# EAGLE board SparkFun_IoT_RedBoard-ESP32_v01 (EAGLE 9.6.2)
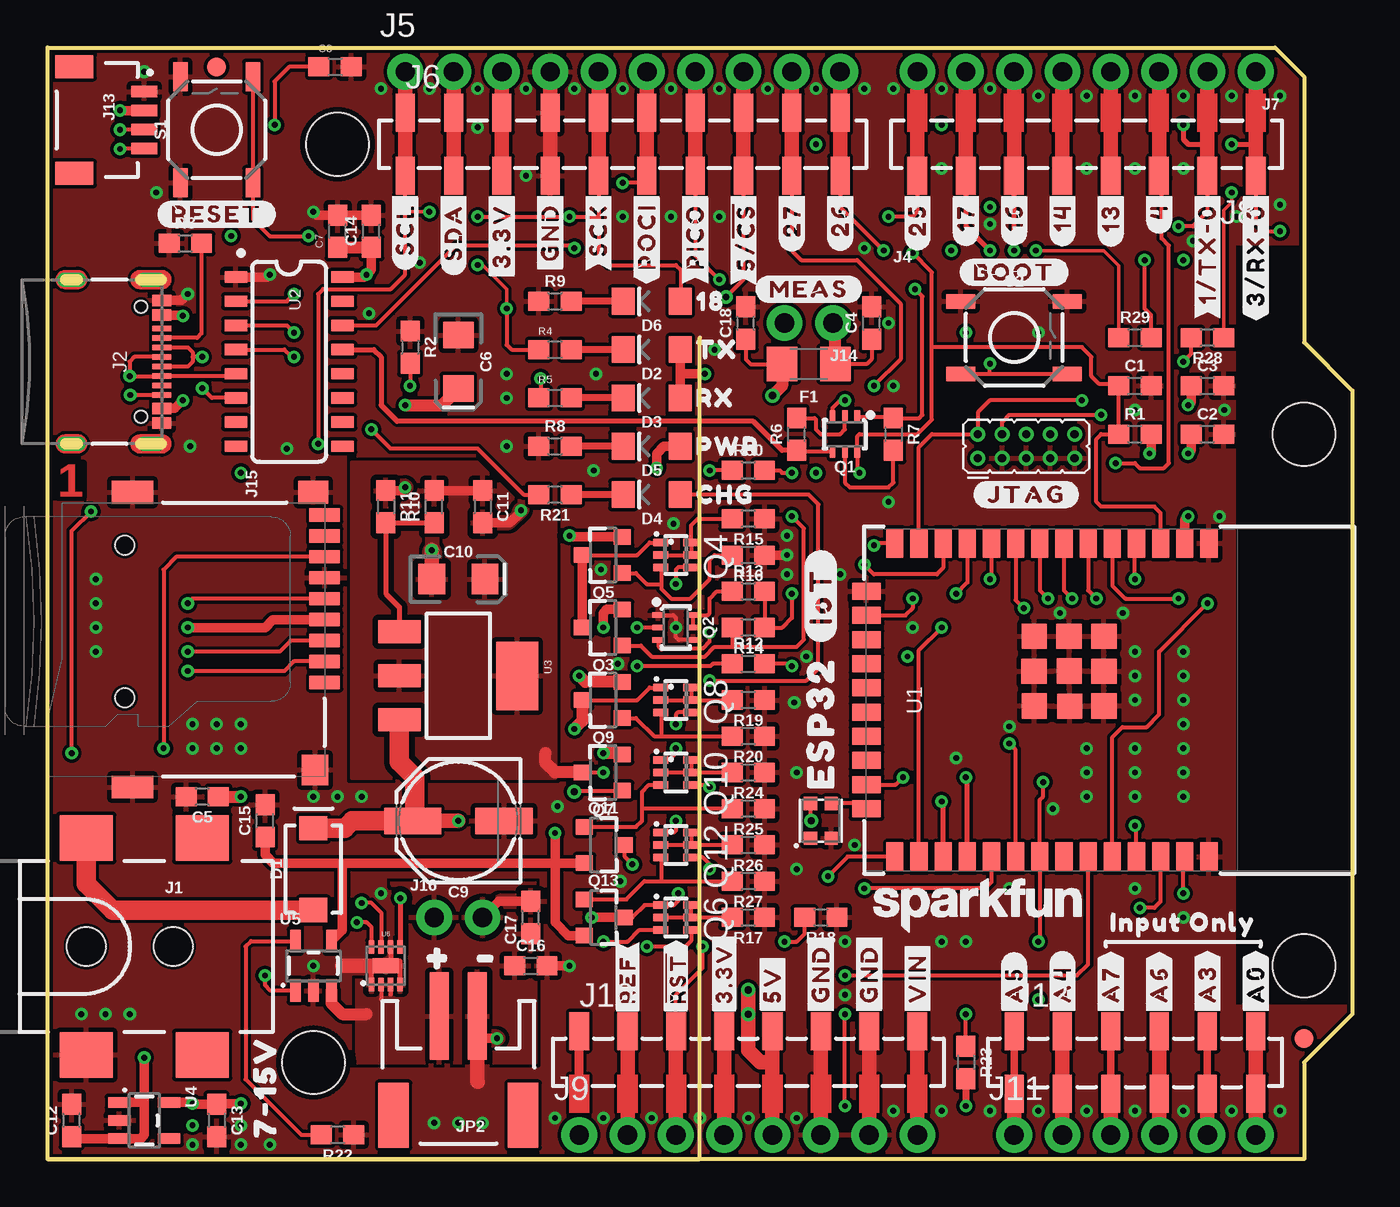
[diagram p1: board, top side]
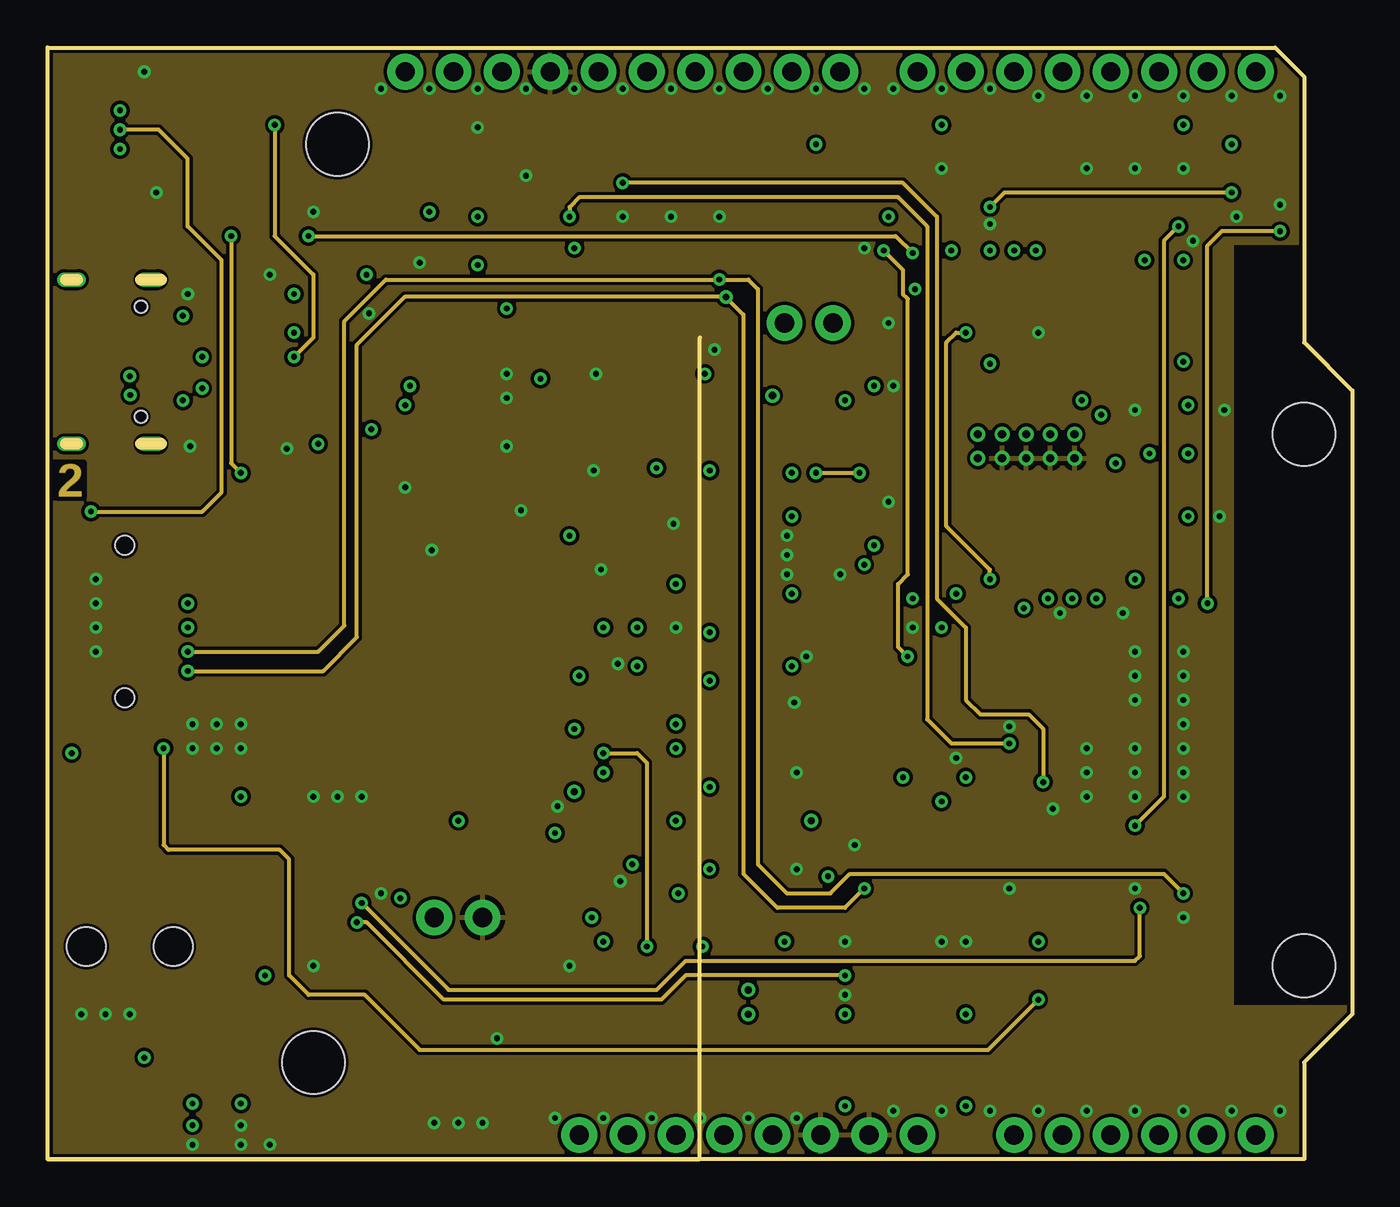
[diagram p2: board, inner layer Route2]
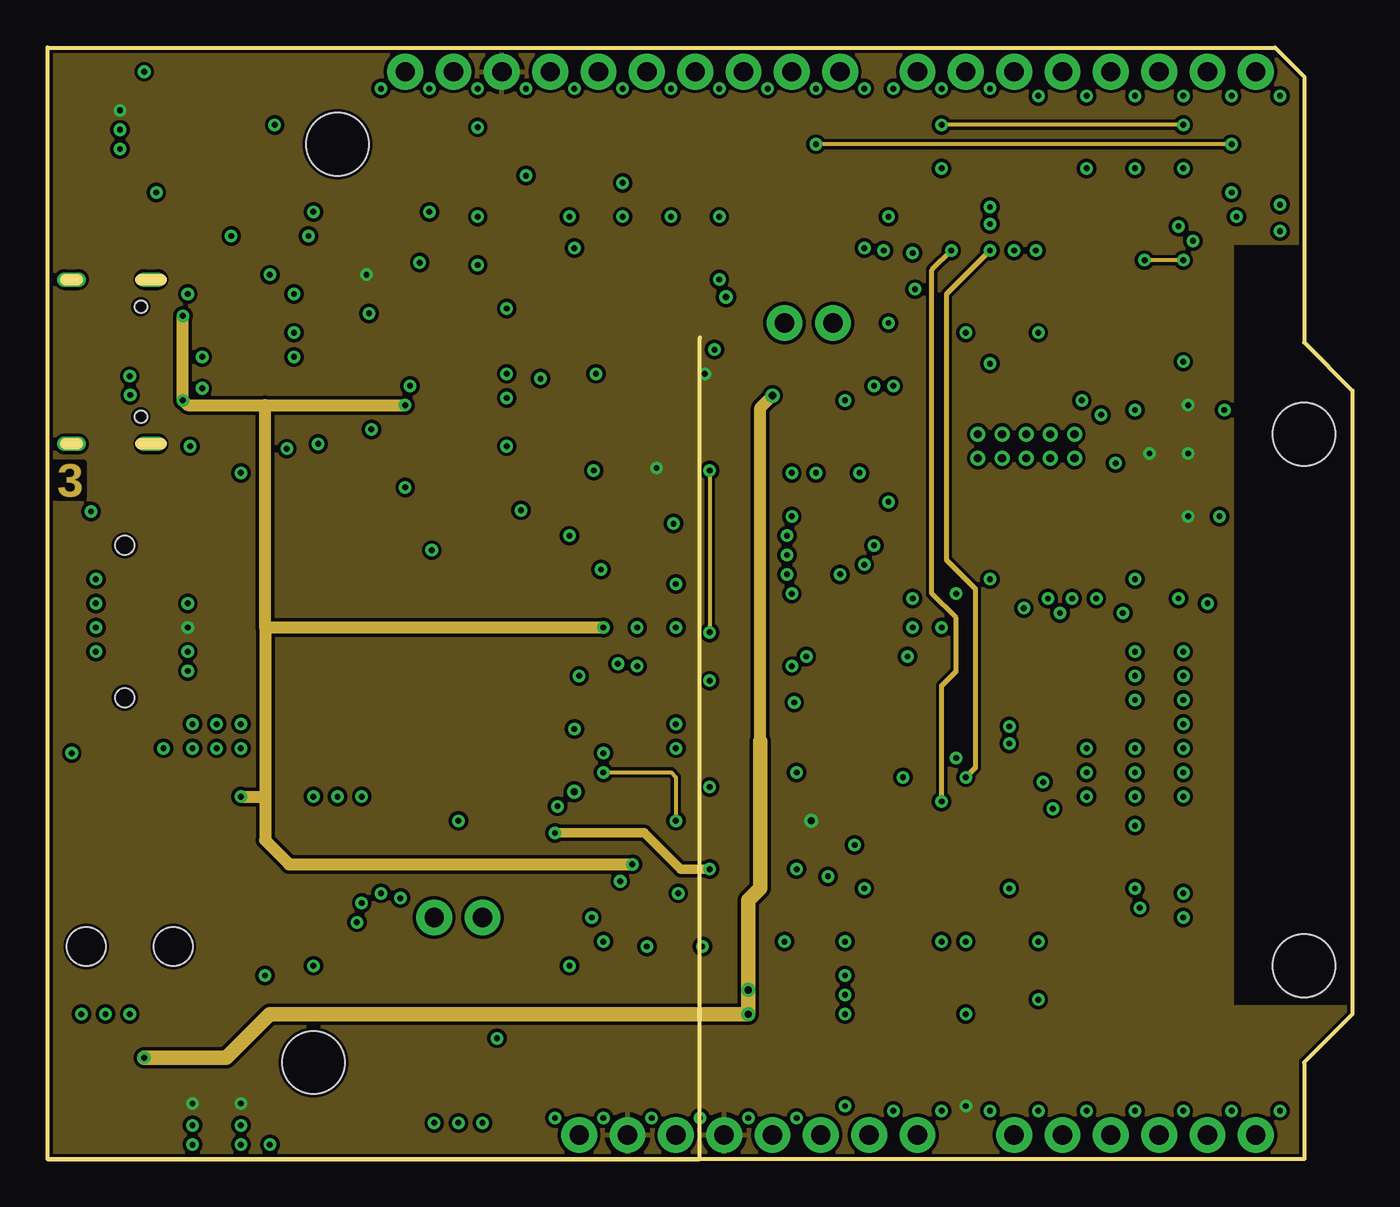
[diagram p3: board, inner layer Route15]
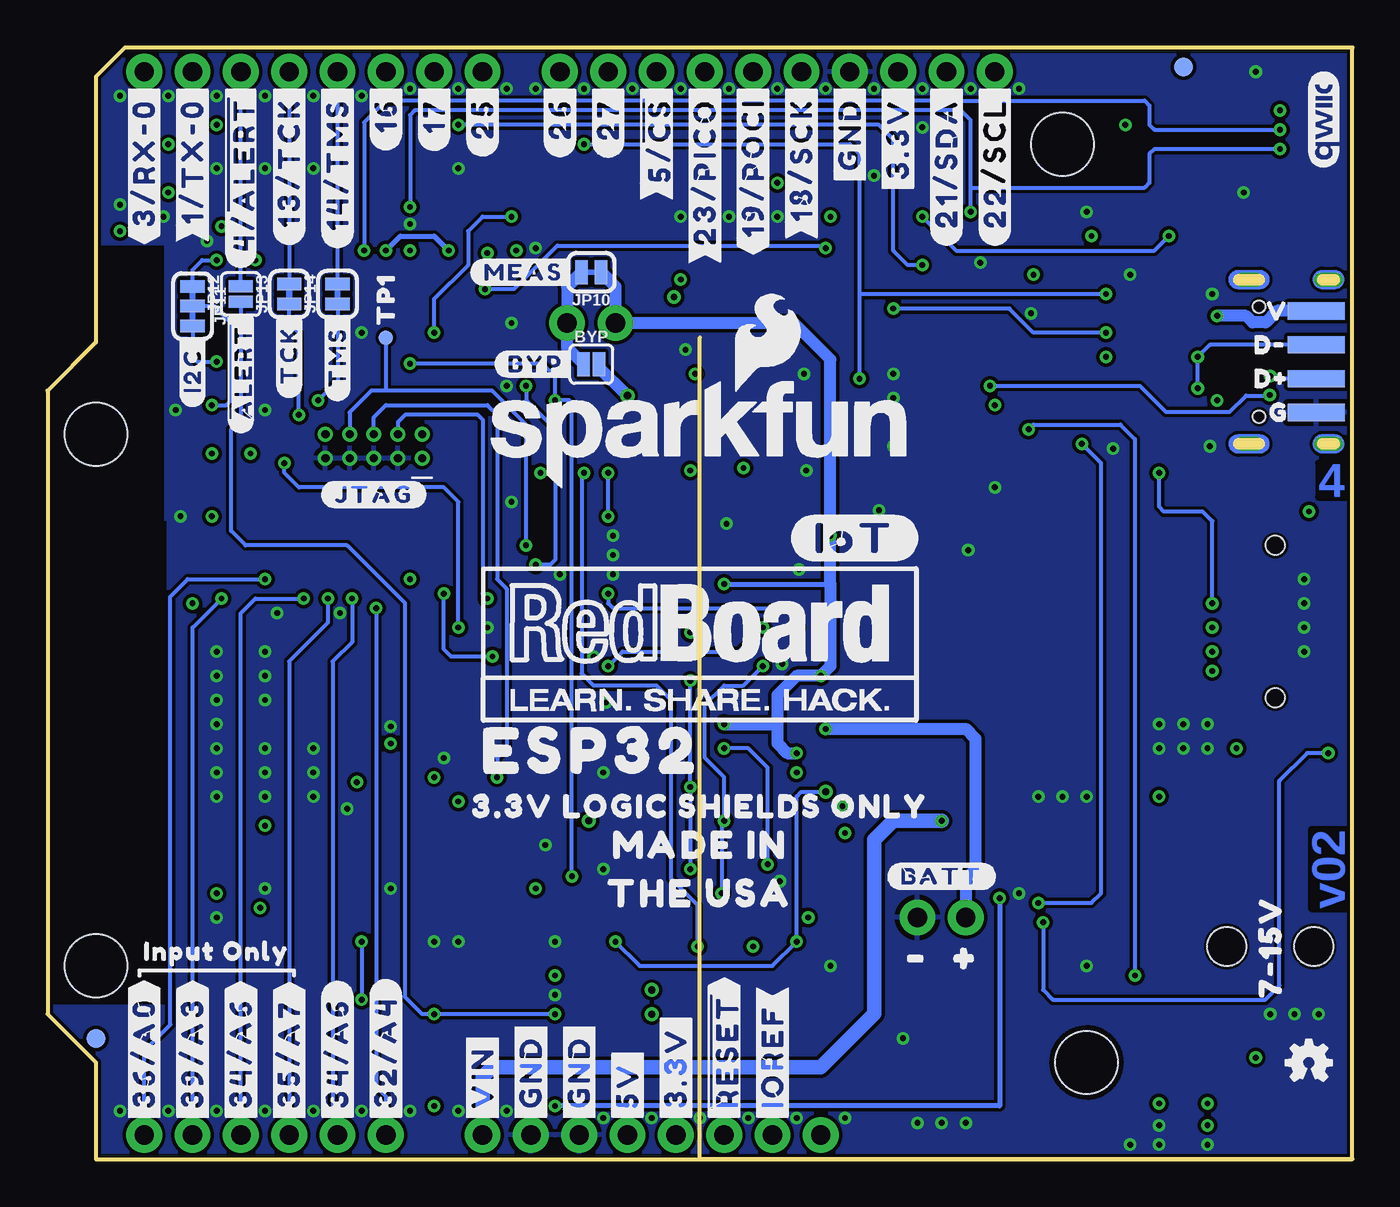
[diagram p4: board, bottom side, seen from below]

Size 68.58 x 58.42 mm. Coordinates in mm from the lower left corner, seen from the top.
Outline: 0,58.42 64.52,58.42 66.04,56.9 66.04,42.93 68.58,40.39 68.58,7.62 66.04,5.08 66.04,0 0,0 0,58.42
Copper layers (1+2*15+16): Top 0.035559375mm / dielectric 0.47751875mm / Route2 0.035559375mm / dielectric 0.47751875mm / Route15 0.035559375mm / dielectric 0.47751875mm / Bottom 0.035559375mm
Design rules "SparkFun-4-Layer-General-JLCPCB": minimum track width 7mil, minimum drill 12mil, track to track 7mil, track to pad 7mil, pad to pad 7mil, via to via 7mil, smd to smd 7mil, copper to edge 7mil, drill to drill 7mil, minimum pad ring 7mil, minimum via ring 7mil, stop-mask expansion 3mil, vias tented up to drill 25mil, thermal gap 10mil
tRestrict: area 62.5,8.1 to 68.6,48
bRestrict: area 62.5,15 to 68.6,33.3; area 62.5,8.1 to 68.6,48
vRestrict: area 0.6,22.4 to 2,30.6; area 5.7,23.1 to 7.4,30.6; area 47.9,10.8 to 48.5,11.3; area 50.4,10.7 to 50.9,11.6; area 11.3,29.3 to 12.7,31.6; area 0.3,13 to 9.4,25
Milling: 2 lines

## Footprints (pad centres in the part's own frame; a part is rotated, then mirrored left to right if it is on the bottom)
SMT-JUMPER_2_NO_SILK = smd 0.635 x 1.27: 1 -0.406,0; 2 0.406,0
0603 = smd 1.1 x 1: 1 -0.85,0; 2 0.85,0
EIA3216 = smd 1.4 x 1.6: + 1.4,0; - -1.4,0
PANASONIC_D = smd 3 x 1.4: + 2.4,0; - -2.4,0
SMA-DIODE = smd 1.27 x 1.47: A -2.15,0; C 2.15,0
LED-1206-HIDDENSILK = smd 1.2 x 1.4: A -1.5,0; C 1.5,0
WS2812-2020 = smd 0.7 x 0.7: DI -0.915,0.55; DO 0.915,-0.55; GND 0.915,0.55; VCC -0.915,-0.55
1206 = smd 1.6 x 1.8: 1 -1.4,0; 2 1.4,0
POWER_JACK_SMD = smd 2.8 x 2.4: GND 0,-5.7; P$4 6.1,-5.7; VIN0 0,5.7; VIN1 6.1,5.7 | hole 2.032: 0,0; 4.572,0
USB-C-16P-2LAYER-PADS = smd 0.3 x 1: A5 -1.25,-0.34; A6 -0.25,-0.34; A7 0.25,-0.34; A8 1.25,-0.34; B5 1.75,-0.34; B6 0.75,-0.34; B7 -0.75,-0.34; B8 -1.75,-0.34 | smd 0.6 x 1: GND -3.225,-0.34; GND2 3.225,-0.34; VBUS1 -2.45,-0.34; VBUS2 2.45,-0.34 | drill 0.4 pad 0.6 long: SHLD1 -4.318,-0.915; SHLD2 4.318,-0.915; SHLD3 -4.318,-5.095; SHLD4 4.318,-5.095 | hole 0.65: -2.89,-1.445; 2.89,-1.445
USB-SOLDER-PADS = smd 3 x 0.9: D+ 0,-0.889; D- 0,0.889; GND 0,-2.667; VBUS 0,2.667
2X5_PTH_SILK_.05 = drill 0.432: 1 0,0; 2 0,1.27; 3 1.27,0; 4 1.27,1.27; 5 2.54,0; 6 2.54,1.27; 7 3.81,0; 8 3.81,1.27; 9 5.08,0; 10 5.08,1.27
1X10_NO_SILK = drill 1.016 pad 1.88: 1 0,0; 2 2.54,0; 3 5.08,0; 4 7.62,0; 5 10.16,0; 6 12.7,0; 7 15.24,0; 8 17.78,0; 9 20.32,0; 10 22.86,0
1X10_SMD_COMBINED = smd 1 x 2: 1A 0,1.65; 1B 0,-1.65; 2A 2.54,1.65; 2B 2.54,-1.65; 3A 5.08,1.65; 3B 5.08,-1.65; 4A 7.62,1.65; 4B 7.62,-1.65; 5A 10.16,1.65; 5B 10.16,-1.65; 6A 12.7,1.65; 6B 12.7,-1.65; 7A 15.24,1.65; 7B 15.24,-1.65; 8A 17.78,1.65; 8B 17.78,-1.65; 9A 20.32,1.65; 9B 20.32,-1.65; 10A 22.86,1.65; 10B 22.86,-1.65
1X08_NO_SILK = drill 1.016 pad 1.88: 1 0,0; 2 2.54,0; 3 5.08,0; 4 7.62,0; 5 10.16,0; 6 12.7,0; 7 15.24,0; 8 17.78,0
1X08_SMD_COMBINED = smd 1 x 2: 1 0,1.65; 2 2.54,1.65; 3 5.08,1.65; 4 7.62,1.652; 5 10.16,1.65; 6 12.7,1.652; 7 15.24,1.65; 8 17.78,1.652
1X06_NO_SILK = drill 1.016 pad 1.88: 1 0,0; 2 2.54,0; 3 5.08,0; 4 7.62,0; 5 10.16,0; 6 12.7,0
1X06_SMD_STRAIGHT_COMBO = smd 1 x 2: 1 0,-1.65; 1-2 0,1.65; 2 2.54,1.65; 2-2 2.54,-1.65; 3 5.08,-1.65; 3-2 5.08,1.65; 4 7.62,1.65; 4-2 7.62,-1.65; 5 10.16,-1.65; 5-2 10.16,1.65; 6 12.7,1.65; 6-2 12.7,-1.65
JST04_1MM_RA = smd 0.6 x 1.35: 1 -1.5,0; 2 -0.5,0; 3 0.5,0; 4 1.5,0 | smd 1.2 x 2: NC1 2.8,-3.675; NC2 -2.8,-3.675
1X02_NO_SILK = drill 1.016 pad 1.88: 1 0,0; 2 2.54,0
MICROSD-EXTERNALPIN = smd 0.7 x 1.6: 1 2.25,10.5; 2 1.15,10.5; 3 0.05,10.5; 4 -1.05,10.5; 5 -2.15,10.5; 6 -3.25,10.5; 7 -4.35,10.5; 8 -5.45,10.5; 9 -6.55,10.5 | smd 1.2 x 1.6: 10 -7.75,9.9 | smd 1.2 x 2.2: 11 -7.75,0.4; 12 7.75,0.4 | smd 1.6 x 1.4: 13 6.85,10 | hole 1: 3.05,0; -4.95,0
FIDUCIAL-1X2 = smd 1 x 1: 1 0,0
JST-2-SMD = smd 1 x 4.6: 1 -1,-3.7; 2 1,-3.7 | smd 1.6 x 3.4: NC1 -3.4,1.5; NC2 3.4,1.5
STAND-OFF = hole 3.302: 0,0
SMT-JUMPER_2_NC_TRACE_SILK = smd 0.66 x 1.27: 1 -0.521,0; 2 0.521,0
SMT-JUMPER_3_2-NC_TRACE_SILK = smd 0.66 x 1.27: 1 -1.041,0; 2 0,0; 3 1.041,0
SC70-6 = smd 0.3 x 0.66: 1 -0.65,-0.92; 2 0,-0.92; 3 0.65,-0.92; 4 0.65,0.92; 5 0,0.92; 6 -0.65,0.92
SOT23-3 = smd 0.8 x 0.9: 1 -0.95,-1; 2 0.95,-1; 3 0,1.1
SOT363_PHILIPS = smd 0.4 x 0.8: 1 -0.65,-0.8; 2 0,-0.8; 3 0.65,-0.8; 4 0.65,0.8; 5 0,0.8; 6 -0.65,0.8
TACTILE_SWITCH_SMD_5.2MM = smd 1.524 x 0.762: 1 -2.794,1.905; 2 2.794,1.905; 3 -2.794,-1.905; 4 2.794,-1.905
PAD.03X.03 = smd 0.762 x 0.762: 1 0,0
ESP-WROOM-32D-NARROW = smd 0.9 x 1.5: 1 6.43,8.238; 2 5.16,8.238; 3 3.89,8.238; 4 2.62,8.238; 5 1.35,8.238; 6 0.08,8.238; 7 -1.19,8.238; 8 -2.46,8.238; 9 -3.73,8.238; 10 -5,8.238; 11 -6.27,8.238; 12 -7.54,8.238; 13 -8.81,8.238; 14 -10.08,8.238; 25 -10.08,-8.238; 26 -8.81,-8.238; 27 -7.54,-8.238; 28 -6.27,-8.238; 29 -5,-8.238; 30 -3.73,-8.238; 31 -2.46,-8.238; 32 -1.19,-8.238; 33 0.08,-8.238; 34 1.35,-8.238; 35 2.62,-8.238; 36 3.89,-8.238; 37 5.16,-8.238; 38 6.43,-8.238 | smd 1.5 x 0.9: 15 -11.57,5.715; 16 -11.57,4.445; 17 -11.57,3.175; 18 -11.57,1.905; 19 -11.57,0.635; 20 -11.57,-0.635; 21 -11.57,-1.905; 22 -11.57,-3.175; 23 -11.57,-4.445; 24 -11.57,-5.715 | smd 1.33 x 1.33: GND1 -0.912,1.531; GNDT1 -2.751,3.346; GNDT2 -2.761,1.516; GNDT3 -2.751,-0.314; GNDT4 -0.891,-0.324; GNDT5 0.909,-0.314; GNDT6 0.909,1.516; GNDT7 0.909,3.346; GNDT8 -0.921,3.346
SO016 = smd 0.6 x 1.2: 1 -4.445,-2.8; 2 -3.175,-2.8; 3 -1.905,-2.8; 4 -0.635,-2.8; 5 0.635,-2.8; 6 1.905,-2.8; 7 3.175,-2.8; 8 4.445,-2.8; 9 4.445,2.8; 10 3.175,2.8; 11 1.905,2.8; 12 0.635,2.8; 13 -0.635,2.8; 14 -1.905,2.8; 15 -3.175,2.8; 16 -4.445,2.8
SOT223 = smd 1.219 x 2.235: 1 -2.311,-3.099; 2 0,-3.099; 3 2.311,-3.099 | smd 3.6 x 2.2: 4 0,3.099
SOT23-5 = smd 0.55 x 1.2: 1 -0.95,-1.3; 2 0,-1.3; 3 0.95,-1.3; 4 0.95,1.3; 5 -0.95,1.3
DFN-8 = smd 0.3 x 0.7: 1 -0.75,-0.99; 2 -0.25,-0.99; 3 0.25,-0.99; 4 0.75,-0.99; 5 0.75,0.99; 6 0.25,0.99; 7 -0.25,0.99; 8 -0.75,0.99 | smd 1.38 x 0.8: 9 0,0

## Placement (x,y rotation side)
BYP  JUMPER-SMT_2_NO_SILK  [SMT-JUMPER_2_NO_SILK]  40.01,41.78 0 bottom
C1  0.1uF  [0603]  57.15,40.64 0 top
C2  0.1uF  [0603]  60.96,38.1 0 top
C3  10uF  [0603]  60.96,40.64 0 top
C4  0.1uF  [0603]  43.31,43.94 90 top
C5  0.1uF  [0603]  8.13,19.05 180 top
C6  10uF  [EIA3216]  21.59,41.91 270 top
C7  0.1uF  [0603]  15.24,48.77 90 top
C8  10nF  [0603]  15.11,57.4 0 top
C9  47uF  [PANASONIC_D]  21.59,17.78 180 top
C10  10uF  [EIA3216]  21.59,30.48 0 top
C11  0.1uF  [0603]  22.86,34.29 270 top
C12  0.1uF  [0603]  1.27,2.03 90 top
C13  0.1uF  [0603]  8.89,2.03 270 top
C14  10uF  [0603]  17.02,48.77 90 top
C15  4.7uF  [0603]  11.43,17.78 90 top
C16  4.7uF  [0603]  25.4,10.16 0 top
C17  0.1uF  [0603]  25.4,12.7 90 top
C18  0.1uF  [0603]  36.7,43.94 90 top
D1  1A/40V/500mV  [SMA-DIODE]  13.97,15.24 90 top
D2  GREEN  [LED-1206-HIDDENSILK]  31.75,42.55 180 top
D3  YELLOW  [LED-1206-HIDDENSILK]  31.75,40.01 180 top
D4  YELLOW  [LED-1206-HIDDENSILK]  31.75,34.92 180 top
D5  GREEN  [LED-1206-HIDDENSILK]  31.75,37.47 180 top
D6  BLUE  [LED-1206-HIDDENSILK]  31.75,45.09 180 top
D7  WS2812_2020  [WS2812-2020]  40.64,17.78 270 top
F1  6V/0.75A  [1206]  40.01,41.78 180 top
FRAME1  FRAME-LEDGER  [CREATIVE_COMMONS]  19.56,-40.89 0 top  (outside the outline)
J1  5.5x2.1mm Barrel  [POWER_JACK_SMD]  2.03,11.18 0 top
J2  USB C  [USB-C-16P-2LAYER-PADS]  6.35,41.91 270 top
J3  USB_SOLDER_PADS  [USB-SOLDER-PADS]  1.91,41.91 0 bottom
J4  [2X5_PTH_SILK_.05]  48.9,36.83 0 top
J5  M10NO_SILK  [1X10_NO_SILK]  18.8,57.15 0 top
J6  [1X10_SMD_COMBINED]  18.8,53.34 0 top
J7  [1X08_NO_SILK]  63.5,57.15 180 top
J8  [1X08_SMD_COMBINED]  63.5,53.34 180 top
J9  [1X08_NO_SILK]  27.94,1.27 0 top
J10  [1X08_SMD_COMBINED]  27.94,5.08 0 top
J11  [1X06_NO_SILK]  50.8,1.27 0 top
J12  [1X06_SMD_STRAIGHT_COMBO]  50.8,5.08 0 top
J13  QWIIC_RIGHT_ANGLE  [JST04_1MM_RA]  5.08,54.61 270 top
J14  [1X02_NO_SILK]  41.27,43.94 180 top
J15  MICRO-SD-PUSH-PUSH-EXT-PIN  [MICROSD-EXTERNALPIN]  4.06,27.3 270 top
J16  [1X02_NO_SILK]  20.32,12.7 0 top
JP1  FIDUCIAL1X2  [FIDUCIAL-1X2]  66.04,6.35 0 top
JP2  LiPo  [JST-2-SMD]  21.59,3.81 180 top
JP3  STAND-OFF  [STAND-OFF]  13.97,5.08 0 top
JP4  STAND-OFF  [STAND-OFF]  66.04,10.16 0 top
JP5  STAND-OFF  [STAND-OFF]  66.04,38.1 0 top
JP6  STAND-OFF  [STAND-OFF]  15.24,53.34 0 top
JP7  FIDUCIAL1X2  [FIDUCIAL-1X2]  8.89,57.4 0 bottom
JP8  FIDUCIAL1X2  [FIDUCIAL-1X2]  66.04,6.35 0 bottom
JP9  FIDUCIAL1X2  [FIDUCIAL-1X2]  8.89,57.4 0 top
JP10  JUMPER-SMT_2_NC_TRACE_SILK  [SMT-JUMPER_2_NC_TRACE_SILK]  40.01,46.61 180 bottom
JP11  JUMPER-SMT_3_2-NC_TRACE_SILK  [SMT-JUMPER_3_2-NC_TRACE_SILK]  60.96,44.83 270 bottom
JP12  JUMPER-SMT_2_NO_SILK  [SMT-JUMPER_2_NO_SILK]  58.42,45.47 90 bottom
JP13  JUMPER-SMT_2_NC_TRACE_SILK  [SMT-JUMPER_2_NC_TRACE_SILK]  55.88,45.47 90 bottom
JP14  JUMPER-SMT_2_NC_TRACE_SILK  [SMT-JUMPER_2_NC_TRACE_SILK]  53.34,45.47 90 bottom
LOGO1  SFE_LOGO_NAME.1_INCH  [SFE_LOGO_NAME_.1]  48.9,13.34 0 top
LOGO2  QWIIC_LOGO_5MM  [QWIIC_5MM]  1.52,54.61 90 bottom
LOGO3  OSHW-LOGOMINI  [OSHW-LOGO-MINI]  2.29,5.08 0 bottom
LOGO5  SPECIAL_INSTRUCTIONS-ORDERING  [ORDERING_INSTRUCTIONS]  76.2,58.42 0 top  (outside the outline)
LOGO6  SFE_LOGO_NAME_FLAME.2_INCH  [SFE_LOGO_NAME_FLAME_.2]  34.29,38.1 0 bottom
Q1  MBT3904DW1T1  [SC70-6]  41.91,38.1 180 top
Q2  [SC70-6]  33.02,27.94 270 top
Q3  20V/4.2A/52mΩ/1.4W  [SOT23-3]  29.21,27.94 90 top
Q4  [SOT363_PHILIPS]  33.02,31.75 270 top
Q5  20V/4.2A/52mΩ/1.4W  [SOT23-3]  29.21,31.75 90 top
Q6  [SOT363_PHILIPS]  33.02,12.7 270 top
Q7  20V/4.2A/52mΩ/1.4W  [SOT23-3]  29.21,20.32 90 top
Q8  [SOT363_PHILIPS]  33.02,24.13 270 top
Q9  20V/4.2A/52mΩ/1.4W  [SOT23-3]  29.21,24.13 90 top
Q10  [SOT363_PHILIPS]  33.02,20.32 270 top
Q11  20V/4.2A/52mΩ/1.4W  [SOT23-3]  29.21,16.51 270 top
Q12  [SOT363_PHILIPS]  33.02,16.51 270 top
Q13  20V/4.2A/52mΩ/1.4W  [SOT23-3]  29.21,12.7 270 top
R1  10k  [0603]  57.15,38.1 0 top
R2  5.1k  [0603]  19.05,42.67 270 top
R3  5.1k  [0603]  7.24,48.13 0 top
R4  1k  [0603]  26.67,42.55 0 top
R5  1k  [0603]  26.67,40.01 0 top
R6  10k  [0603]  39.37,38.1 90 top
R7  10k  [0603]  44.45,38.1 270 top
R8  2.2k  [0603]  26.67,37.47 0 top
R9  4.7k  [0603]  26.67,45.09 0 top
R10  240  [0603]  20.32,34.29 90 top
R11  715  [0603]  17.78,34.29 270 top
R12  10k  [0603]  36.83,26.04 0 top
R13  10k  [0603]  36.83,29.84 0 top
R14  10k  [0603]  36.83,27.94 180 top
R15  10k  [0603]  36.83,33.66 180 top
R16  47k  [0603]  36.83,31.75 180 top
R17  100k  [0603]  36.83,12.7 180 top
R18  1M  [0603]  40.64,12.7 180 top
R19  100k  [0603]  36.83,24.13 180 top
R20  1M  [0603]  36.83,22.23 180 top
R21  1k  [0603]  26.67,34.92 180 top
R22  2.0k  [0603]  15.24,1.27 180 top
R23  10k  [0603]  48.26,5.08 270 top
R24  100k  [0603]  36.83,20.32 180 top
R25  1M  [0603]  36.83,18.41 180 top
R26  100k  [0603]  36.83,16.51 180 top
R27  1M  [0603]  36.83,14.61 180 top
R28  2.2k  [0603]  60.96,43.18 180 top
R29  2.2k  [0603]  57.15,43.18 0 top
R30  100  [0603]  36.83,36.2 0 top
S1  Reset  [TACTILE_SWITCH_SMD_5.2MM]  8.89,54.1 90 top
S2  GPIO0  [TACTILE_SWITCH_SMD_5.2MM]  50.8,43.18 0 top
TP1  TEST-POINT3  [PAD.03X.03]  50.8,43.18 0 bottom
U1  ESP-WROOM-3232D-NARROW  [ESP-WROOM-32D-NARROW]  54.61,24.13 0 top
U2  CH340C  [SO016]  12.7,41.91 270 top
U3  LM1117  [SOT223]  21.59,25.4 270 top
U4  3.3V  [SOT23-5]  5.08,2.03 270 top
U5  MCP73831  [SOT23-5]  13.97,10.16 0 top
U6  MAX17048  [DFN-8]  17.78,10.16 0 top
U$3  [#SCL#34]  18.8,50.93 90 top
U$4  [#SDA#33]  21.34,50.93 90 top
U$5  [#3#3V#33]  23.88,50.93 90 top
U$6  [#GND#32]  26.42,50.93 90 top
U$7  [#SCK#31]  28.96,50.93 90 top
U$8  [#POCI#30]  31.5,50.93 90 top
U$9  [#PICO#29]  34.04,50.93 90 top
U$10  [1836]  33.4,45.09 0 top
U$11  [#MEAS#0]  46.35,46.61 0 bottom
U$12  [#27#27]  39.12,50.93 90 top
U$13  [#26#26]  41.66,50.93 90 top
U$14  [TX1838]  33.4,42.55 0 top
U$15  [RX1839]  33.4,40.01 0 top
U$16  [PWR1837]  33.4,37.47 0 top
U$17  [CHG1840]  33.4,34.92 0 top
U$18  [#25#18]  45.72,50.93 90 top
U$19  [#17#17]  48.26,50.93 90 top
U$20  [#16#15]  50.8,50.93 90 top
U$21  [#14#14]  53.34,50.93 90 top
U$22  [#13#5]  55.88,50.93 90 top
U$23  [#4#2]  58.42,50.93 90 top
U$24  [#3#RX#0#4]  63.5,56.64 90 bottom
U$25  [#3#RX#0#0]  63.5,50.93 90 top
U$26  [#RESET#1842]  8.89,49.66 0 top
U$27  [#BOOT#1841]  50.8,46.61 0 top
U$28  [#JTAG#1847]  51.44,34.92 0 top
U$29  [#A0#1843]  63.5,7.49 90 top
U$30  [#A3#1843]  60.96,7.49 90 top
U$31  [#A6#1843]  58.42,7.49 90 top
U$32  [#A7#1843]  55.88,7.49 90 top
U$33  [#A4#1843]  53.34,7.49 90 top
U$34  [#A5#1843]  50.8,7.49 90 top
U$35  [#VIN#1843]  45.72,7.49 90 top
U$36  [#GND#1844]  43.18,7.49 90 top
U$37  [#GND#1844]  40.64,7.49 90 top
U$38  [#5V#1845]  38.1,7.49 90 top
U$39  [#3#3V#1845]  35.56,7.49 90 top
U$40  [##RST##1845]  33.02,7.49 90 top
U$41  [#REF#1846]  30.48,7.49 90 top
U$42  [#MEAS#1851]  40.01,45.72 0 top
U$43  [#1849]  20.57,10.54 0 top
U$44  [#1850]  23.11,10.54 0 top
U$45  [#BATT#1848]  21.59,14.86 0 bottom
U$46  [#JTAG#1847]  51.44,34.92 0 bottom
U$47  [#IOT#132321874]  26.16,32.64 0 bottom
U$48  [ESP321855]  40.64,18.41 90 top
U$49  [7#15V32321861]  11.43,3.81 90 top
U$50  [#39#A3#321862]  60.96,1.78 90 bottom
U$51  [#36#A0#321862]  63.5,1.78 90 bottom
U$52  [#34#A6#32321865]  53.34,1.78 90 bottom
U$53  [#35#A7#321862]  55.88,1.78 90 bottom
U$54  [#32#A4#32321865]  50.8,1.78 90 bottom
U$55  [#34#A6#321862]  58.42,1.78 90 bottom
U$56  [#VIN#321862]  45.72,1.78 90 bottom
U$57  [#GND#321863]  43.18,1.78 90 bottom
U$58  [#5V#321864]  38.1,1.78 90 bottom
U$59  [#3#3V#321864]  35.56,1.78 90 bottom
U$60  [#GND#321863]  40.64,1.78 90 bottom
U$61  [##RESET##321864]  33.02,1.78 90 bottom
U$62  [#IOREF#321865]  30.48,1.78 90 bottom
U$63  [#5##CS##0]  36.58,50.93 90 top
U$64  [#BYP#0]  45.09,41.78 0 bottom
U$66  [#13#TCK#32321869]  55.88,56.64 90 bottom
U$67  [#14#TMS#32321869]  53.34,56.64 90 bottom
U$68  [#16#32321869]  50.8,56.64 90 bottom
U$69  [#17#32321869]  48.26,56.64 90 bottom
U$70  [#25#32321869]  45.72,56.64 90 bottom
U$71  [#26#32321869]  41.66,56.64 90 bottom
U$72  [#5##CS##32321869]  36.58,56.64 90 bottom
U$73  [#23#PICO#321866]  34.04,56.64 90 bottom
U$74  [#19#POCI#321866]  31.5,56.64 90 bottom
U$75  [#18#SCK#32321869]  28.96,56.64 90 bottom
U$76  [#21#SDA#32321869]  21.34,56.64 90 bottom
U$77  [#22#SCL#32321869]  18.8,56.64 90 bottom
U$78  [#27#32321869]  39.12,56.64 90 bottom
U$79  [#GND#321866]  26.42,56.64 90 bottom
U$80  [#3#3V#321866]  23.88,56.64 90 bottom
U$83  [D#32321863]  2.79,42.8 0 bottom
U$84  [D#32321862]  2.67,41.02 0 bottom
U$85  [G32321864]  2.67,39.24 0 bottom
U$86  [#1849]  20.32,10.54 0 bottom
U$87  [V323252]  2.67,44.58 0 bottom
U$88  [#1850]  22.86,10.54 0 bottom
U$89  [#I2C#1855]  60.96,43.31 90 bottom
U$90  [##ALERT##1852]  58.42,44.58 90 bottom
U$91  [#TMS#1854]  53.34,44.45 90 bottom
U$92  [#TCK#1853]  55.88,44.45 90 bottom
U$93  [ESP32321856]  40.01,21.46 0 bottom
U$94  [MADE_IN32321857]  34.29,16.51 0 bottom
U$95  [TP1321868]  50.8,45.21 90 bottom
U$96  [INPUT_ONLY321867]  59.69,12.45 0 top
U$97  [INPUT_ONLY321867]  59.69,10.92 0 bottom
U$98  [REDBOARD_LOGO]  45.72,22.86 0 bottom
U$99  [THE_USA32321858]  34.29,13.97 0 bottom
U$100  [#IOT#132321869]  40.64,29.59 90 top
U$101  [7#15V32321861]  4.32,11.18 90 bottom
U$102  [#4##ALERT##0]  58.42,56.64 90 bottom
U$103  [3#3V_LOGIC_SHIELDS_ONLY132321876]  34.29,18.54 0 bottom
U$104  [#1#TX#0#0]  60.96,50.93 90 top
U$105  [#1#TX#0#2]  60.96,56.64 90 bottom

## Tracks (layer width: path | path; a pad name or v marks a point on that pad's centre or on a via)
3.3V  (via drill 0.3, 0.38)
  Top 0.203: D7.VCC 40.09,17.82 v40.13,17.78
  Top 0.381: R23.2 v48.26,2.79
  Top 0.508: U2.16 16.64,46.35 v16.76,46.48 17.02,46.74 C14.1 | J13.2 v3.82,55.11 v3.81,55.12 | R1.2 58,37.17 v57.91,37.08 | C2.1 60.11,37.25 v59.94,37.08 | C3.1 60.11,39.79 v59.94,39.62 | U1.2 59.77,33.61 v59.94,33.78 | D2.A 33.25,41.15 | 33.25,41.15 D3.A | v10.16,2.92 8.93,2.92 C13.1 7.66,2.88 v7.62,2.92 7.56,2.98 U4.5 | 33.25,41.15 33.38,41.27 v34.54,41.27 | J15.4 11.85,28.36 11.43,27.94 v7.37,27.94 | v32,36.32 32,37.08 32.38,37.47 D5.A
  Top 0.635: C7.1 C14.1
  Top 0.762: J5.3 J6.3A J6.3B | J9.2 J10.2 | J9.4 J10.4
  Bottom 0.203: v59.94,39.62 59.18,39.62 58.93,39.88 58.93,43.94 59.82,44.83 JP11.2
  pour Route15: 0,58.42 68.58,58.42 68.58,48.13 62.23,48.13 62.23,8 68.58,8 68.58,0 0,0
5V  (via drill 0.3, 0.38)
  Top 0.203: C18.1 36.7,42.04 36.96,41.78 F1.2
  Top 0.508: C12.1 1.37,1.08 U4.3 4.89,1.08 5.08,1.27 5.08,3.05 | 5.08,3.05 v5.08,5.33 | U4.1 5.01,2.98 5.08,3.05
  Top 0.635: F1.2 38.6,40.64 v38.1,40.13
  Top 0.762: J9.5 38.1,5.08 | J10.5 38.1,5.08 | 38.1,5.08 37.47,5.08 36.83,5.71 v36.83,8.89
  Route15 0.635: 37.47,21.97 37.47,39.5 v38.1,40.13
  Route15 0.762: v5.08,5.33 9.4,5.33 11.68,7.62 v36.83,7.62 v36.83,8.89 36.83,13.6 37.47,14.24 37.47,21.97
  Bottom 0.635: BYP.2 39.6,41.63 v38.1,40.13
5V_CHG  (via drill 0.3)
  Top 0.203: Q10.4 34.69,19.67 v34.8,19.56 | v34.8,15.24 34.8,15.49 34.43,15.86 Q12.4 | D4.A 40.01,34.92 40.51,34.42 40.51,25.78 39.88,25.15 v34.8,25.15
  Top 0.508: U5.4 15.49,12.03 15.49,15.56 | C15.1 11.43,16 11.87,15.56 15.49,15.56 | 15.49,15.56 26.67,15.56 | 26.67,15.56 Q11.2 | 26.67,15.56 v26.67,17.14 | Q13.2 27.37,11.75 26.67,12.45 26.67,15.56
  Route15 0.508: v26.67,17.14 31.37,17.14 33.27,15.24 v34.8,15.24
  Bottom 0.203: v34.8,15.24 v34.8,19.56 v34.8,25.15
5V_EXT  (via drill 0.3)
  Top 0.203: Q13.3 30.73,12.7 31.38,13.35 Q6.1 32.91,13.35 33.15,13.59 v33.15,13.97 | v33.02,17.78 33.02,17.27 32.91,17.16 Q12.1 | R12.1 34.96,26.04 34.84,25.91 v30.99,25.91 | Q7.3 v29.21,20.32
  Top 0.508: Q13.3 v28.6,12.7 | R10.2 C11.1
  Top 0.635: Q7.3 26.67,20.32 26.16,20.83 26.16,21.34
  Route15 0.203: v29.21,20.32 32.77,20.32 33.02,20.07 v33.02,17.78
  Bottom 0.203: v33.15,13.97 33.15,17.65 v33.02,17.78 33.02,20.07 34.04,21.08 34.04,23.88 33.02,24.89 32,24.89 v30.99,25.91
  pour Top (isolate 0.305): 16,20.07 26.67,20.07 26.67,36.58 16,36.58
5V_MEAS  (via drill 0.3)
  Top 0.203: Q4.4 33.13,31.1 33.02,30.99 v33.02,30.23 | Q8.4 33.13,23.48 33.02,23.37 v33.02,22.86 | v31.5,11.18 33.53,11.18 33.82,11.47 Q6.4
  Top 0.508: Q5.2 27.5,32.7 v27.43,32.77
  Top 0.635: Q9.2 28.26,25.08 v27.94,25.4 | Q7.2 30.14,21.34 v29.21,21.34
  Route2 0.203: v29.21,21.34 30.99,21.34 31.5,20.83 v31.5,11.18
  Bottom 0.254: v33.02,30.23 27.43,30.23
  Bottom 0.635: 30.23,22.86 30.23,24.38 29.21,25.4 v27.94,25.4 27.43,25.91 27.43,30.23 v27.43,32.77 27.43,42.04 29.34,43.94 J14.2 38.73,45.86 JP10.1 | 30.23,22.86 30.23,21.84 29.72,21.34 v29.21,21.34 | v33.02,22.86 30.23,22.86
!DTR!
  Top 0.203: Q1.4 39.44,37.18 R6.1
  Top 0.254: R6.1 38.61,37.25 37.08,38.77 18.38,38.77 17.53,39.62 17.53,42.16 17.14,42.55 U2.13
!GAUGE_ALERT!  (via drill 0.3)
  Top 0.203: R23.1 v48.26,7.62 | v41.91,2.79 v41.91,7.62
  Top 0.254: v18.54,13.72 18.54,11.16 U6.5
  Bottom 0.203: JP12.1 58.42,38.86 58.93,38.35 58.93,33.02 58.17,32.26 52.83,32.26 49.78,29.21 49.78,9.65 49.78,8.51 48.9,7.62 v48.26,7.62 v41.91,7.62
  Bottom 0.254: v18.54,13.72 18.54,2.79 v41.91,2.79
!RTS!  (via drill 0.3)
  Top 0.203: Q1.1 44.38,39.02 R7.1 45.81,38.95 45.97,39.12 45.97,45.34 v45.59,45.72 | U2.14 17.27,43.81 21.46,48.01 27.56,48.01 v27.69,47.88
  Bottom 0.203: v27.69,47.88 27.81,48.01 41.78,48.01 44.07,45.72 v45.59,45.72
CC1
  Top 0.203: J2.A5 7.85,43.16 8.09,43.4 R3.2
CC2  (via drill 0.3)
  Top 0.203: v4.35,40.16 J2.B5 | R2.2 v19.05,40.64
  Bottom 0.203: v19.05,40.64 11.18,40.64 9.8,39.27 6.45,39.27 5.59,40.13 4.32,40.13 v4.35,40.16
D+  (via drill 0.3)
  Top 0.203: U2.5 9.77,41.15 6,41.15 | 6,41.15 v4.32,41.15 4.32,41.91 4.57,42.16 J2.A6 | 6,41.15 J2.B6
  Bottom 0.203: J3.D+ 3.68,41.02 3.81,41.15 v4.32,41.15
D-  (via drill 0.3)
  Top 0.203: J2.B7 7.38,42.66 7.62,42.42 7.62,42.16 | 7.62,42.16 7.62,41.91 7.37,41.66 J2.A7 | U2.6 8.64,40.01 v8.13,40.51 | v8.13,42.16 7.62,42.16
  Bottom 0.203: v8.13,40.51 v8.13,42.16 7.49,42.8 J3.D-
ESP32_0  (via drill 0.3)
  Top 0.203: U1.25 42.05,15.89 v41.02,14.86 | Q1.3 41.26,39.48 41.66,39.88 v41.91,39.88 | S2.3 49.53,41.27 | 49.53,41.27 S2.4 | 49.53,41.27 v49.53,41.81
  Bottom 0.203: v41.02,14.86 41.02,39.75 41.15,39.88 v41.91,39.88 41.91,41.15 42.57,41.81 v49.53,41.81
ESP32_ADC0  (via drill 0.3)
  Top 0.203: v57.15,30.48 57.15,32.29 U1.4
  Top 0.762: J12.6 J11.6
  Bottom 0.203: J11.6 63.5,5.7 62.13,7.07 62.13,29.57 61.21,30.48 v57.15,30.48
ESP32_ADC3  (via drill 0.3)
  Top 0.203: U1.5 55.96,30.15 56.64,29.46 v59.44,29.46
  Top 0.762: J12.5 J11.5
  Bottom 0.203: v59.44,29.46 60.96,27.94 J11.5
ESP32_ADC4  (via drill 0.3)
  Top 0.203: U1.8 52.15,29.89 v52.58,29.46
  Top 0.762: J12.2 J11.2
  Bottom 0.203: v52.58,29.46 52.58,27.18 53.59,26.16 53.59,1.52 J11.2
ESP32_ADC5  (via drill 0.3)
  Top 0.203: U1.9 50.88,29.38 v51.31,28.96
  Top 0.762: J12.1 J11.1
  Bottom 0.203: v51.31,28.96 51.31,3.81 50.8,3.3 J11.1
ESP32_ADC6  (via drill 0.3)
  Top 0.203: U1.6 54.69,29.89 v55.12,29.46
  Top 0.762: J12.4 J11.4
  Bottom 0.203: J11.4 58.42,28.7 57.66,29.46 v55.12,29.46
ESP32_ADC7  (via drill 0.3)
  Top 0.203: U1.7 53.42,29.89 v53.85,29.46
  Top 0.762: J12.3 J11.3
  Bottom 0.203: v53.85,29.46 53.85,28.19 55.88,26.16 J11.3
ESP32_EN  (via drill 0.3)
  Top 0.203: J10.3 33.02,8.64 34.42,10.03 v34.42,11.18 | U1.3 58.5,33.96 58.17,34.29 55.37,34.29 55.12,34.54 55.12,37.85 55.37,38.1 R1.1 C1.1 56.3,40.73 55.28,40.73 54.86,41.15 54.86,42.16 54.36,42.67 46.48,42.67 | v45.47,47.62 46.48,46.61 46.48,42.67 | 46.48,42.67 46.48,38.86 45.72,38.1 42.67,38.1 42.56,37.99 Q1.6 42.56,36.18 v42.67,36.07 | S1.4 S1.3 10.79,49.4 11.68,48.51 v13.72,48.51
  Top 0.762: J9.3 J10.3
  Route2 0.203: v45.47,47.62 44.58,48.51 v13.72,48.51 | v40.39,36.07 v42.67,36.07
  Bottom 0.203: v34.42,11.18 34.42,13.34 35.81,14.73 35.81,24.13 36.58,24.89 39.88,24.89 40.51,25.53 40.51,35.94 v40.39,36.07
ESP32_GPIO2
  Top 0.203: U1.24 42.76,18.7 D7.DI
ESP32_GPIO4  (via drill 0.3)
  Top 0.203: U1.26 45.8,26.75 v46.99,27.94 | 58.55,51.56 58.55,48.39 58.93,48.01 58.93,36.58 58.67,36.32 57.4,36.32 57.15,36.58 v56.13,36.58
  Top 0.762: J7.3 J8.3 58.55,51.56
  Bottom 0.203: v46.99,27.94 46.99,34.54 47.75,35.31 55.37,35.31 56.13,36.07 v56.13,36.58 | JP12.2 J7.3
ESP32_GPIO5_!CS!  (via drill 0.3, 0.35)
  Top 0.203: U1.29 49.61,14.56 49.28,14.22 v42.93,14.22 | J15.2 12.95,26.16 12.45,25.65 v7.37,25.65 | J6.8B 36.58,46.23 v35.66,45.31
  Top 0.762: J5.8 J6.8A J6.8B
  Route2 0.203: v42.93,14.22 41.91,13.21 38.35,13.21 36.58,14.99 36.58,44.39 v35.66,45.31 v35.65,45.31 18.77,45.31 16.26,42.8 16.26,27.43 14.48,25.65 v7.37,25.65
ESP32_GPIO12_TDI  (via drill 0.3)
  Top 0.203: U1.14 43.54,32.37 v43.43,32.26
  Bottom 0.203: v43.43,32.26 43.43,38.61 45.21,40.39 50.8,40.39 | 50.8,40.39 51.56,40.39 52.7,39.24 J4.8 | TP1.1 50.8,40.39
ESP32_GPIO13_HDR
  Top 0.762: J7.4 J8.4
  Bottom 0.203: J7.4 JP13.2
ESP32_GPIO13_TCK  (via drill 0.3)
  Top 0.203: U1.16 45.09,28.57 45.47,28.96 v45.47,29.46 | J4.4 50.16,38.73 50.55,39.12 v55.37,39.12
  Bottom 0.203: J4.4 50.16,38.73 49.78,39.12 45.97,39.12 45.72,38.86 45.72,29.72 v45.47,29.46 | v55.37,39.12 55.37,43.43 55.88,43.94 JP13.1
ESP32_GPIO14_HDR
  Top 0.762: J7.5 J8.5
  Bottom 0.203: JP14.2 J7.5
ESP32_GPIO14_TMS  (via drill 0.3)
  Top 0.203: U1.13 45.8,37.42 46.48,38.1 J4.2 48.9,39.24 49.53,39.88 v54.36,39.88
  Bottom 0.203: JP14.1 53.34,40.89 v54.36,39.88
ESP32_GPIO15_TDO  (via drill 0.3)
  Top 0.203: U1.23 44.58,19.68 v44.96,20.07
  Bottom 0.203: J4.6 51.44,38.99 50.8,39.62 45.47,39.62 44.96,39.12 44.96,30.48 44.45,29.97 44.45,21.59 44.96,21.08 v44.96,20.07
ESP32_GPIO16  (via drill 0.3)
  Top 0.254: U1.27 47.07,18.72 v46.99,18.8 | v50.8,47.75 J8.6
  Top 0.762: J7.6 J8.6
  Route15 0.254: v46.99,18.8 46.99,24.89 47.75,25.65 47.75,28.45 46.48,29.72 46.48,46.74 v47.5,47.75
  Bottom 0.254: v50.8,47.75 50.04,48.51 48.26,48.51 v47.5,47.75
ESP32_GPIO17  (via drill 0.3)
  Top 0.254: U1.28 48.34,19.99 v48.26,20.07 | J8.7 48.26,49.02 v49.53,47.75
  Top 0.762: J7.7 J8.7
  Route15 0.254: v49.53,47.75 47.24,45.47 47.24,31.5 48.77,29.97 48.77,20.57 v48.26,20.07
ESP32_GPIO18_SCK  (via drill 0.3)
  Top 0.203: J6.5B 28.96,49.53 | 28.96,49.53 28.96,47.5 29.46,46.99 33.02,46.99 33.27,46.74 33.27,45.11 D6.A | U1.30 50.88,21.51 v50.55,21.84 | J15.5 7.61,29.45 v7.37,29.21 | v22.61,49.53 v27.43,49.53 28.96,49.53
  Top 0.762: J5.5 J6.5A J6.5B
  Route2 0.203: v50.55,21.84 47.5,21.84 46.23,23.11 46.23,49.02 44.7,50.55 27.94,50.55 27.43,50.04 v27.43,49.53 | v10.16,36.07 9.65,36.58 v9.65,48.51
  Bottom 0.203: v22.61,49.53 20.83,47.75 10.41,47.75 v9.65,48.51 | v7.37,29.21 7.37,33.53 7.87,34.04 9.91,34.04 10.16,34.29 v10.16,36.07
ESP32_GPIO19_POCI  (via drill 0.3)
  Top 0.203: v30.23,51.31 31.11,51.31 J6.6B | v52.32,19.81 52.32,19.05 52.15,18.88 U1.31 52.15,11.51 v52.07,11.43 | J15.7 6.76,31.66 6.1,30.99 v6.1,21.59
  Top 0.762: J5.6 J6.6A J6.6B
  Route2 0.203: v30.23,51.31 44.96,51.31 46.74,49.53 46.74,29.46 48.26,27.94 48.26,24.13 49.02,23.37 51.56,23.37 52.32,22.61 v52.32,19.81 | v52.07,8.38 49.43,5.74 19.56,5.74 16.66,8.64 13.72,8.64 12.7,9.65 12.7,15.75 12.19,16.26 6.35,16.26 6.1,16.51 v6.1,21.59
  Bottom 0.203: v52.07,11.43 v52.07,8.38
ESP32_GPIO23_PICO  (via drill 0.3)
  Top 0.203: J6.7B 34.04,47.5 v35.31,46.23 | v59.69,13.97 59.69,15.81 U1.37 | J15.3 12.78,27.25 12.19,26.67 v7.37,26.67
  Top 0.762: J5.7 J6.7A J6.7B
  Route2 0.203: v59.69,13.97 58.67,14.99 42.16,14.99 41.15,13.97 38.86,13.97 37.34,15.49 37.34,45.72 36.83,46.23 v35.31,46.23 17.78,46.23 15.6,44.04 15.6,28.04 14.22,26.67 v7.37,26.67
ESP32_GPIO25  (via drill 0.3)
  Top 0.203: U1.10 49.61,30.56 v49.53,30.48 | J8.8 45.72,49.78 45.47,49.53 v44.2,49.53
  Top 0.762: J7.8 J8.8
  Route2 0.203: v49.53,30.48 49.53,30.99 47.24,33.27 47.24,42.93 47.75,43.43 v48.26,43.43
  Bottom 0.203: v44.2,49.53 45.72,49.53 46.48,48.77 46.48,46.99 48.26,45.21 v48.26,43.43
ESP32_GPIO26  (via drill 0.3)
  Top 0.203: v47.75,29.72 48.34,30.31 U1.11 | J6.10B 41.66,50.04 v43.94,47.75
  Top 0.762: J5.10 J6.10A J6.10B
  Route2 0.203: v45.19,26.42 44.7,26.9 44.7,30.23 45.21,30.73 45.21,45.21 44.96,45.47 44.96,46.74 v43.94,47.75
  Bottom 0.203: v45.19,26.42 47.37,26.42 47.75,26.8 v47.75,29.72
ESP32_GPIO27  (via drill 0.3)
  Top 0.203: U1.12 47.07,31.07 46.74,30.73 43.43,30.73 v42.93,31.24 | v43.43,40.64 44.83,42.04 44.83,44.96 42.55,47.24 39.62,47.24 39.12,47.75 J6.9B
  Top 0.762: J5.9 J6.9A J6.9B
  Bottom 0.203: v43.43,40.64 43.43,39.88 41.91,38.35 41.91,31.5 42.16,31.24 v42.93,31.24
ESP32_RXD0  (via drill 0.3)
  Top 0.203: U2.2 12.57,45.09 v12.95,45.47 | v25.91,41.02 25.91,40.09 R5.1 | U1.34 55.96,22.18 56.49,22.71 57.76,22.71 58.42,23.37 58.42,26.67 v60.96,29.21 | J8.1 63.5,49.28 64.01,48.77 v64.77,48.77
  Top 0.254: v62.23,53.34 63.5,53.34
  Top 0.762: J7.1 63.5,53.34 J8.1
  Route2 0.203: v60.96,29.21 60.96,48.01 61.72,48.77 v64.77,48.77
  Route15 0.203: v62.23,53.34 v40.39,53.34
  Bottom 0.203: v12.95,45.47 25.91,45.47 | 25.91,45.47 v25.91,41.02 | v40.39,53.34 26.42,53.34 25.91,52.83 25.91,45.47
ESP32_SCL  (via drill 0.3)
  Top 0.178: 18.8,49.78 v20.07,49.78 | v62.23,50.8 62.23,50.29 61.81,49.87 R28.1
  Top 0.203: v16.51,13.46 17.02,13.46 17.53,12.95 U6.7 | v14.22,37.59 14.22,45.47 14.48,45.72 18.03,45.72 18.8,46.48 18.8,49.78 18.8,51.82 | J13.4 3.83,53.11 v3.81,53.09 | v57.4,13.21 58.17,13.21 58.5,13.54 U1.36
  Top 0.762: J5.1 J6.1A 18.8,51.82 J6.1B
  Route2 0.203: v62.23,50.8 50.29,50.8 v49.53,50.04 | v16.51,13.46 21.08,8.89 32,8.89 33.53,10.41 57.15,10.41 57.4,10.67 v57.4,13.21
  Bottom 0.203: v16.51,13.46 13.72,13.46 13.21,13.97 13.21,36.58 v14.22,37.59 | v20.07,49.78 20.07,51.05 | 20.07,51.05 20.07,54.61 20.57,55.12 49.28,55.12 49.53,54.86 v49.53,50.04 | 20.07,51.05 10.92,51.05 10.67,51.31 10.67,52.83 10.41,53.09 v3.81,53.09
ESP32_SDA  (via drill 0.3)
  Top 0.178: v51.94,47.75 55.5,47.75 56.3,46.95 R29.1
  Top 0.203: U6.8 17.03,12.18 16.76,12.45 v16.26,12.45 | J13.3 v3.81,54.1 | v41.91,9.65 54.1,9.65 54.69,10.24 U1.33 | v1.27,21.34 1.27,33.02 v2.29,34.04
  Top 0.762: J5.2 J6.2A J6.2B
  Route2 0.203: v41.91,9.65 33.53,9.65 32.26,8.38 20.83,8.38 16.76,12.45 v16.26,12.45 | v3.81,54.1 5.84,54.1 7.37,52.58 7.37,49.02 9.14,47.24 9.14,35.05 8.13,34.04 v2.29,34.04
  Bottom 0.203: J5.2 21.34,55.63 | 21.34,55.63 50.8,55.63 51.94,54.48 v51.94,47.75 | 21.34,55.63 10.92,55.63 10.67,55.37 10.67,54.36 10.41,54.1 v3.81,54.1 | v16.26,12.45 16.26,8.89 15.75,8.38 4.57,8.38 3.83,9.12 3.83,19.89 2.38,21.34 v1.27,21.34
ESP32_TXD0  (via drill 0.3)
  Top 0.178: v24.13,44.7 24.13,45.72 22.86,46.99 v22.61,46.99
  Top 0.203: U2.3 12.57,43.81 v12.95,43.43 | v24.13,44.7 24.13,42.8 24.38,42.55 R4.1 | J8.2 60.96,49.78 60.2,49.02 v59.44,49.02 | U1.35 57.23,17.45 v57.15,17.53
  Top 0.254: v59.69,54.36 59.69,53.59 59.94,53.34 60.96,53.34
  Top 0.762: J7.2 60.96,53.34 J8.2
  Route2 0.203: v59.44,49.02 58.67,48.26 58.67,19.05 v57.15,17.53
  Route15 0.203: v59.69,54.36 v46.99,54.36
  Bottom 0.203: v12.95,43.43 16.76,43.43 18.03,44.7 v24.13,44.7 | v46.99,54.36 24.89,54.36 24.13,53.59 24.13,47.75 23.37,46.99 v22.61,46.99
GND  (via drill 0.3)
  Top 0.203: Q2.4 33.16,27.29 33.02,27.43 v33.02,27.94 33.02,28.45 32.88,28.59 Q2.1
  Top 0.254: U6.6 18.03,10.41 | 18.03,10.41 U6.9 | U6.1 17.02,9.18 17.02,10.16 | U6.4 18.53,10.41 18.03,10.41
  Top 0.508: v23.62,6.35 22.61,6.35 | R11.1 18.63,35.14 v18.8,35.31 | U2.1 11.56,46.35 v11.68,46.48 | R16.1 v38.86,31.75 | J2.GND 7.04,45.13 v7.37,45.47 | C17.2 23.71,13.55 J16.2 | C16.2 v27.43,10.16 | C11.2 24.3,33.44 24.89,34.04 24.89,34.09 v24.88,34.1 | C14.2 C7.2 14.14,49.62 v13.97,49.78
  Top 0.762: J5.4 J6.4A J6.4B | JP2.1 22.59,4.08 22.61,4.06 | U6.9 17.02,10.16 15.49,10.16 | J9.6 J10.6 | J9.7 J10.7 | C10.- v20.19,32
  other vias: 3.05,7.62 4.32,7.62 1.78,7.62 10.16,0.76 7.62,0.76 59.69,26.67 59.69,25.4 59.69,24.13 59.69,22.86 59.69,21.59 59.69,20.32 59.69,19.05 54.61,21.59 54.61,20.32 54.61,19.05 57.15,21.59 57.15,20.32 57.15,19.05 57.15,25.4 57.15,24.13 57.15,26.67 7.49,37.47 24.13,40.01 24.13,41.27 41.91,11.43 48.26,11.43 46.99,11.43 39.37,15.24 42.42,16.51 39.37,20.32 16.51,19.05 15.24,19.05 13.97,19.05 57.15,39.37 52.07,43.43 59.69,52.07 32.77,49.53 30.23,49.53 35.31,49.53 54.61,52.07 57.15,52.07 24.13,37.47 20.32,1.91 21.59,1.91 22.86,1.91 8.89,22.86 10.16,22.86 8.89,21.59 10.16,21.59 2.54,26.67 2.54,27.94 2.54,29.21 2.54,30.48 11.68,0.76 10.16,1.78 38.86,32.77 38.86,30.73 7.62,22.86 7.62,21.59 62.23,2.54 59.69,2.54 57.15,2.54 54.61,2.54 52.07,2.54 64.77,2.54 49.53,2.54 46.99,2.54 44.45,2.54 62.23,55.88 59.69,55.88 57.15,55.88 54.61,55.88 52.07,55.88 64.77,55.88 64.77,50.16 62.48,49.53 39.37,2.16 36.83,2.16 34.29,2.16 31.75,2.16 29.21,2.16 26.67,2.16 49.53,56.26 46.99,56.26 44.45,56.26 40.39,56.26 42.93,56.26 37.85,56.26 35.31,56.26 32.77,56.26 30.23,56.26 27.69,56.26 25.15,56.26 22.61,56.26 20.07,56.26 17.53,56.26 13.97,10.16 61.59,33.78 59.69,12.7 57.15,14.22 47.75,21.08 52.83,18.41 50.55,22.73 45.47,27.94 53.21,28.7 56.52,28.7 61.85,39.37 39.24,24 41.91,8.64 26.8,18.54 5.08,57.15 5.71,50.8 25.15,51.69 12.57,37.34 29.97,26.04 30.1,14.61 50.55,14.22 16.89,44.45 22.61,54.23 46.99,52.07 44.45,40.64 44.2,34.54 41.66,30.73 17.53,13.97 49.53,49.15 44.2,43.94 28.83,41.27 35.05,42.55 29.08,30.99 19.56,47.12 28.7,36.2 32.89,33.4 39.88,26.42 60.2,48.26 42.93,47.88
  pour Route2: 0,58.42 68.71,58.42 68.71,48.13 62.23,48.13 62.23,8 68.58,8 68.58,0 0,0
  pour Top (rank 2): 0,58.42 68.58,58.42 68.58,0 0,0
  pour Bottom: 0,58.42 68.71,58.42 68.71,33.66 62.23,33.66 62.23,14.61 68.58,14.61 68.58,0 0,0
GND1  (via drill 0.3)
  other vias: 7.62,1.78
N$1  (via drill 0.3)
  Top 0.203: U5.1 11.71,8.86 11.43,9.14 v11.43,9.65 | v17.02,38.35 18.03,37.34 22.61,37.34 25.02,34.92 R21.2
  Bottom 0.203: v17.02,38.35 16.76,38.61 12.19,38.61 11.43,37.85 v11.43,9.65
N$2
  Top 0.381: D5.C R8.2
N$3
  Top 0.381: D6.C R9.2
N$4
  Top 0.381: D4.C R21.1
N$5
  Top 0.381: D2.C R4.2
N$6  (via drill 0.3)
  Top 0.203: U2.4 12.45,42.55 12.83,42.16 v12.95,42.16 | C8.1 12.7,57.4 11.94,56.64 v11.94,54.36
  Route2 0.203: v11.94,54.36 11.94,48.51 13.97,46.48 13.97,43.18 v12.95,42.16
N$7
  Top 0.381: D3.C R5.2
N$8
  Top 0.203: Q6.5 Q6.6 | Q6.2 Q6.5 | Q6.5 R17.2
N$9  (via drill 0.3)
  Top 0.203: Q3.1 31.18,26.99 31.75,26.42 34.54,26.42 35.05,26.92 35.94,26.92 | 35.94,26.92 39.37,26.92 39.75,27.3 39.75,33.15 v39.12,33.78 | R14.2 35.98,26.96 35.94,26.92 | R30.2 38.48,36.2 38.61,36.07 v39.12,36.07
  Bottom 0.203: v39.12,33.78 v39.12,36.07
N$10  (via drill 0.3, 0.38)
  Top 0.203: v29.21,11.43 30.48,11.43 31.1,12.05 Q6.3 | v38.73,11.43 39.37,11.43 39.79,11.85 R18.2 | v27.69,19.3 27.75,19.37 Q7.1
  Bottom 0.203: v38.73,11.43 37.47,10.16 30.48,10.16 v29.21,11.43 29.21,19.05 28.96,19.3 v27.69,19.3
N$11  (via drill 0.3)
  Top 0.203: Q2.3 32.1,26.95 32.26,26.8 32.32,26.86 34.45,26.86 34.8,27.21 v34.8,27.69 | R30.1 v34.8,36.2
  Route15 0.203: v34.8,36.2 v34.8,27.69
N$12
  Top 0.203: Q4.2 Q4.5 Q4.6 33.82,33.31 34.16,33.66 R15.2
N$13
  Top 0.203: Q8.2 Q8.5 | Q8.6 Q8.5 | Q8.5 R19.2
N$14
  Top 0.203: R22.2 13.34,1.27 10.41,4.19 10.41,11.18 10.7,11.46 U5.5
N$15
  Top 0.254: U3.1 18.49,29.01 17.78,29.72 R11.2 R10.1
N$16
  Top 0.203: Q5.1 30.92,30.8 31.5,30.23 32.26,30.23 | R16.2 35.05,31.75 34.8,31.5 34.8,30.48 33.78,29.46 32.77,29.46 32.26,29.97 32.26,30.23 | Q4.3 32.26,31.06 32.26,30.23
N$17
  Top 0.203: Q9.1 30.92,23.18 31.88,22.23 32.26,22.23 | 32.26,22.23 R20.2 | Q8.3 32.26,23.44 32.26,22.23
N$18  (via drill 0.3)
  Top 0.203: v59.69,41.91 60.11,42.33 R28.2
  Bottom 0.203: JP11.3 60.96,42.16 60.71,41.91 v59.69,41.91
N$19
  Top 0.203: C4.1 43.31,42.04 43.05,41.78 F1.1
  Top 0.635: F1.1 41.41,43.81 J14.1
  Bottom 0.635: JP10.2 41.27,45.86 J14.1 41.27,42.65 BYP.1
N$20  (via drill 0.3)
  Top 0.203: R29.2 58,44.36 57.66,44.7 v57.66,47.24
  Route15 0.203: v59.69,47.24 v57.66,47.24
  Bottom 0.203: JP11.1 60.96,46.74 60.45,47.24 v59.69,47.24
N$21  (via drill 0.3)
  Top 0.203: Q2.2 v30.99,27.94 | v39.12,25.91 38.99,26.04 R12.2
  Bottom 0.203: v39.12,25.91 38.35,26.67 32.26,26.67 v30.99,27.94
N$22
  Top 0.203: Q2.6 34.04,28.59 | 34.04,28.59 34.69,28.59 34.8,28.7 34.8,29.46 35.18,29.84 R13.1 | Q2.5 33.94,28.49 34.04,28.59
N$23
  Top 0.203: Q11.1 30.92,17.46 31.24,17.78 31.24,18.41 | 31.24,18.41 31.24,19.3 31.61,19.67 Q10.3 | R25.2 31.24,18.41
N$24
  Top 0.203: Q1.5 41.91,35.56 42.16,35.31 44.2,35.31 44.45,35.56 R7.2
N$25
  Top 0.203: R6.2 40.3,38.95 40.39,38.86 40.39,38.35 40.64,38.1 41.66,38.1 41.91,38.35 Q1.2
N$26
  Top 0.203: Q10.2 Q10.5 | Q10.6 Q10.5 | Q10.5 R24.2
N$28
  Top 0.203: Q13.1 30.41,13.65 31.37,14.61 32.26,14.61 | 32.26,14.61 R27.2 | Q12.3 32.26,15.82 32.26,14.61
N$29
  Top 0.203: Q12.6 Q12.5 | Q12.2 Q12.5 | Q12.5 R26.2
PWRIN
  Top 1.016: D1.A 3.42,13.09 2.03,14.48 J1.VIN0
V_BATT  (via drill 0.3)
  Top 0.203: U6.2 17.53,8.39 17.53,8.38 | U6.3 18.03,8.64 | Q9.3 30.99,24.13 31.64,24.78 Q8.1
  Top 0.635: Q9.3 28.11,23.03 v27.69,22.61 | U5.3 14.92,8.19 15.49,7.62 16.76,7.62
  Bottom 0.635: v27.69,22.61 20.32,22.61 19.81,22.1 19.81,15.24 20.32,14.73 J16.1
  pour Top (isolate 0.305): 16.26,14.48 16.26,5.08 25.65,5.08 25.65,14.48
V_USB  (via drill 0.3)
  Top 0.203: R13.2 R14.1 38.61,27.94 39.12,28.45 v39.12,29.72 | Q11.3 30.31,15.92 v30.73,15.49 | v33.02,21.59 33.02,21.34 32.65,20.97 Q10.1
  Top 0.508: Q3.2 29.4,28.89 29.21,28.7 v29.21,27.94 | v7.11,39.88 6.69,39.46 J2.VBUS2 | J2.VBUS1 7.08,44.36 v7.11,44.32
  Top 0.635: v18.8,39.62 20.7,39.62 C6.+ | C5.1 v10.16,19.05
  Route15 0.635: 11.43,27.94 11.43,19.05 | 11.43,19.05 11.43,16.76 12.7,15.49 v30.73,15.49 | v29.21,27.94 11.43,27.94 | 11.43,27.94 11.43,39.62 | 11.43,39.62 v18.8,39.62 | v10.16,19.05 11.43,19.05 | v7.11,44.32 v7.11,39.88 7.37,39.62 11.43,39.62
  Bottom 0.203: v29.21,27.94 29.21,28.7 29.46,28.96 38.86,28.96 39.12,29.21 v39.12,29.72 | v30.73,15.49 30.73,20.57 31.75,21.59 v33.02,21.59
  Bottom 0.635: J3.VBUS 3.97,44.58 4.57,43.98 5.25,43.98 5.59,44.32 v7.11,44.32
VIN  (via drill 0.3)
  Top 0.762: C9.+ v21.59,17.78 | J9.8 J10.8
  Top 1.016: U3.3 18.49,20.88 19.3,20.07 19.3,17.89 C9.+ 16,17.78 15.61,17.39 D1.C
  Bottom 0.762: J9.8 45.72,4.32 45.21,4.83 27.94,4.83 25.12,7.64 25.12,16.79 24.13,17.78 v21.59,17.78
VUSB_PROT
  Top 0.203: Q5.3 30.99,31.75 31.64,32.4 Q4.1
  Top 0.508: Q5.3 Q3.3

## Text on the board
Top: 1
Route2: 2
Route15: 3
Bottom: 4 | v02
Measures: Dimensions in inches.
tDocu: - Finish: HASL-Lead Free | - Board thickness is 1.6mm | - 4 Layer Board | - No clean process | Ricardo Ramos | Revised by: Dryw Wade
214bmp: D:/SmartProjects/Snc/a4_bn_logo2.bmp